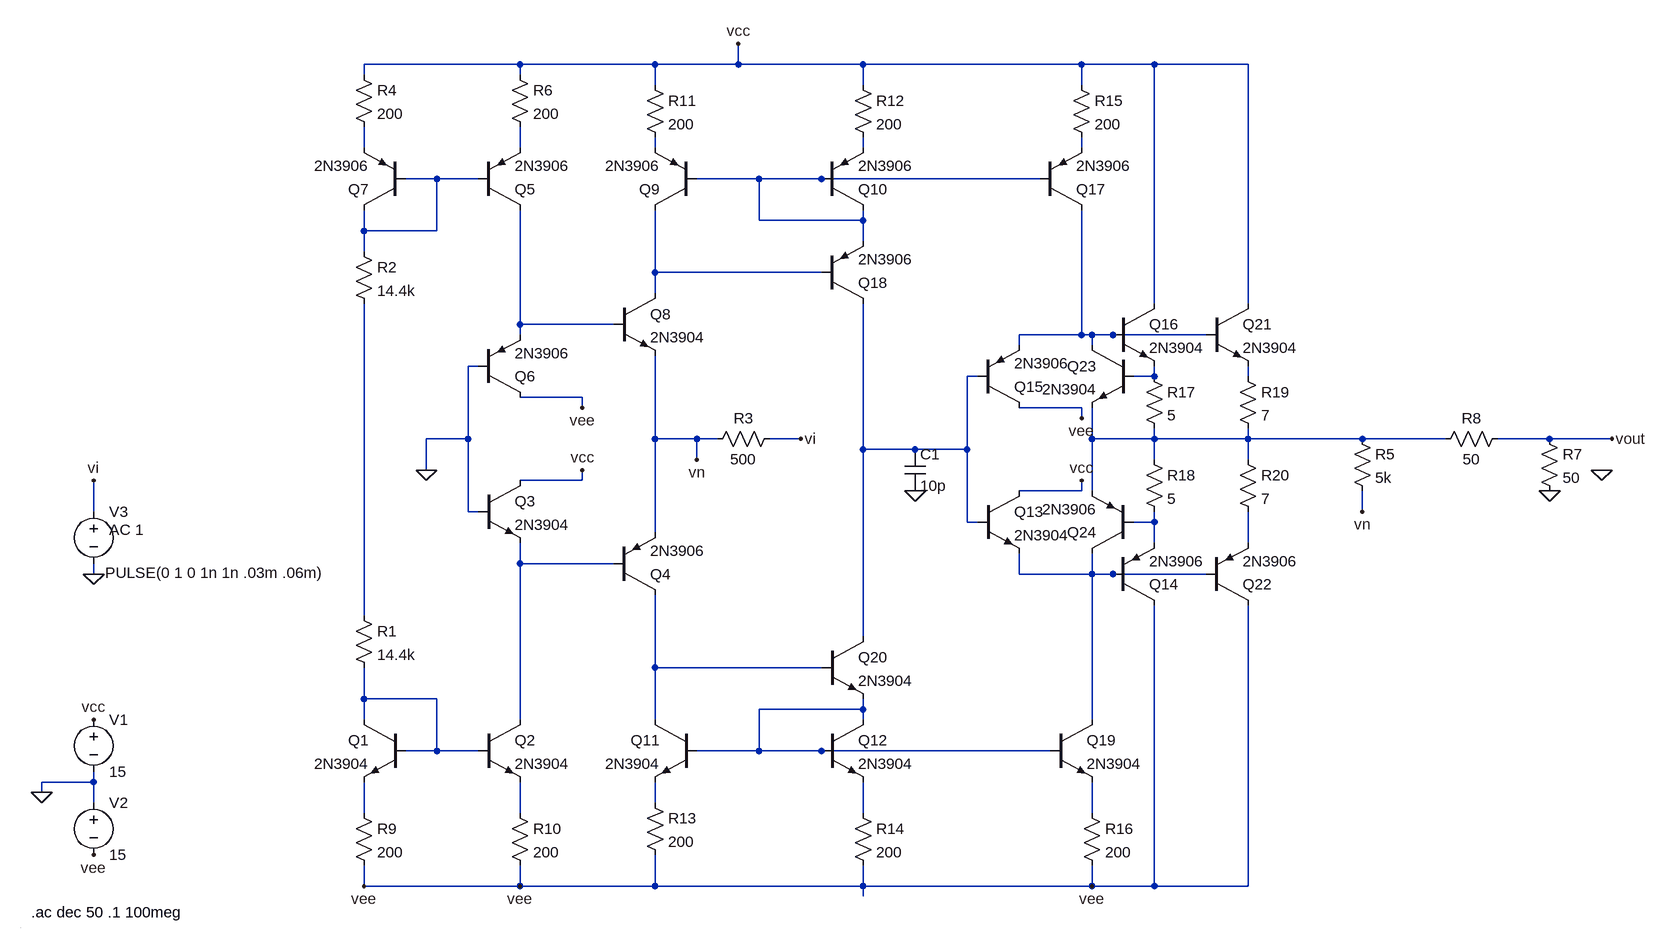
[diagram p0: schematic transimpedance_scratch.asc]
transimpedance_scratch.asc, the LTspice schematic file:
Version 4
SHEET 1 2516 680
WIRE 768 -1328 528 -1328
WIRE 976 -1328 768 -1328
WIRE 1104 -1328 1104 -1360
WIRE 1104 -1328 976 -1328
WIRE 1296 -1328 1104 -1328
WIRE 1632 -1328 1296 -1328
WIRE 1744 -1328 1632 -1328
WIRE 1888 -1328 1744 -1328
WIRE 528 -1312 528 -1328
WIRE 768 -1312 768 -1328
WIRE 976 -1296 976 -1328
WIRE 1296 -1296 1296 -1328
WIRE 1632 -1296 1632 -1328
WIRE 528 -1200 528 -1232
WIRE 768 -1200 768 -1232
WIRE 976 -1200 976 -1216
WIRE 1296 -1200 1296 -1216
WIRE 1632 -1200 1632 -1216
WIRE 640 -1152 592 -1152
WIRE 704 -1152 640 -1152
WIRE 1136 -1152 1040 -1152
WIRE 1232 -1152 1136 -1152
WIRE 1568 -1152 1232 -1152
WIRE 1136 -1088 1136 -1152
WIRE 1296 -1088 1296 -1104
WIRE 1296 -1088 1136 -1088
WIRE 528 -1072 528 -1104
WIRE 640 -1072 640 -1152
WIRE 640 -1072 528 -1072
WIRE 1296 -1056 1296 -1088
WIRE 528 -1040 528 -1072
WIRE 976 -1008 976 -1104
WIRE 1232 -1008 976 -1008
WIRE 976 -976 976 -1008
WIRE 1744 -960 1744 -1328
WIRE 1888 -960 1888 -1328
WIRE 768 -928 768 -1104
WIRE 912 -928 768 -928
WIRE 768 -912 768 -928
WIRE 1632 -912 1632 -1104
WIRE 1632 -912 1536 -912
WIRE 1648 -912 1632 -912
WIRE 1680 -912 1648 -912
WIRE 1824 -912 1680 -912
WIRE 1536 -896 1536 -912
WIRE 1648 -896 1648 -912
WIRE 704 -864 688 -864
WIRE 1472 -848 1456 -848
WIRE 1744 -848 1744 -864
WIRE 1744 -848 1712 -848
WIRE 1888 -848 1888 -864
WIRE 864 -816 768 -816
WIRE 864 -800 864 -816
WIRE 1632 -800 1536 -800
WIRE 1632 -784 1632 -800
WIRE 688 -752 688 -864
WIRE 688 -752 624 -752
WIRE 976 -752 976 -880
WIRE 1040 -752 976 -752
WIRE 1072 -752 1040 -752
WIRE 1200 -752 1152 -752
WIRE 1648 -752 1648 -800
WIRE 1744 -752 1744 -768
WIRE 1744 -752 1648 -752
WIRE 1888 -752 1888 -768
WIRE 1888 -752 1744 -752
WIRE 2064 -752 1888 -752
WIRE 2192 -752 2064 -752
WIRE 2352 -752 2272 -752
WIRE 2448 -752 2352 -752
WIRE 1296 -736 1296 -960
WIRE 1376 -736 1296 -736
WIRE 1456 -736 1456 -848
WIRE 1456 -736 1376 -736
WIRE 976 -608 976 -752
WIRE 1040 -720 1040 -752
WIRE 1744 -720 1744 -752
WIRE 1888 -720 1888 -752
WIRE 624 -704 624 -752
WIRE 864 -688 864 -704
WIRE 864 -688 768 -688
WIRE 1632 -672 1632 -688
WIRE 1632 -672 1536 -672
WIRE 1648 -672 1648 -752
WIRE 112 -640 112 -688
WIRE 688 -640 688 -752
WIRE 704 -640 688 -640
WIRE 2064 -640 2064 -672
WIRE 1456 -624 1456 -736
WIRE 1472 -624 1456 -624
WIRE 1744 -624 1744 -640
WIRE 1744 -624 1712 -624
WIRE 1744 -592 1744 -624
WIRE 1888 -592 1888 -640
WIRE 768 -560 768 -592
WIRE 912 -560 768 -560
WIRE 112 -544 112 -560
WIRE 1536 -544 1536 -576
WIRE 1648 -544 1648 -576
WIRE 1648 -544 1536 -544
WIRE 1680 -544 1648 -544
WIRE 1824 -544 1680 -544
WIRE 528 -480 528 -960
WIRE 1296 -448 1296 -736
WIRE 976 -400 976 -512
WIRE 1232 -400 976 -400
WIRE 528 -352 528 -400
WIRE 640 -352 528 -352
WIRE 1296 -336 1296 -352
WIRE 1296 -336 1136 -336
WIRE 528 -320 528 -352
WIRE 768 -320 768 -560
WIRE 976 -320 976 -400
WIRE 1296 -320 1296 -336
WIRE 1648 -320 1648 -544
WIRE 640 -272 640 -352
WIRE 640 -272 592 -272
WIRE 704 -272 640 -272
WIRE 1136 -272 1136 -336
WIRE 1136 -272 1040 -272
WIRE 1232 -272 1136 -272
WIRE 1584 -272 1232 -272
WIRE 112 -224 112 -240
WIRE 112 -224 32 -224
WIRE 32 -208 32 -224
WIRE 112 -192 112 -224
WIRE 976 -192 976 -224
WIRE 528 -176 528 -224
WIRE 768 -176 768 -224
WIRE 1296 -176 1296 -224
WIRE 1648 -176 1648 -224
WIRE 528 -64 528 -96
WIRE 768 -64 768 -96
WIRE 768 -64 528 -64
WIRE 976 -64 976 -112
WIRE 976 -64 768 -64
WIRE 1296 -64 1296 -96
WIRE 1296 -64 976 -64
WIRE 1648 -64 1648 -96
WIRE 1648 -64 1296 -64
WIRE 1744 -64 1744 -496
WIRE 1744 -64 1648 -64
WIRE 1888 -64 1888 -496
WIRE 1888 -64 1744 -64
WIRE 1296 -48 1296 -64
WIRE 0 0 0 0
FLAG 32 -208 0
FLAG 112 -320 vcc
FLAG 112 -112 vee
FLAG 528 -64 vee
FLAG 768 -64 vee
FLAG 1104 -1360 vcc
FLAG 864 -704 vcc
FLAG 864 -800 vee
FLAG 112 -544 0
FLAG 1632 -688 vcc
FLAG 1632 -784 vee
FLAG 1648 -64 vee
FLAG 2352 -672 0
FLAG 624 -704 0
FLAG 112 -688 vi
FLAG 1200 -752 vi
FLAG 1040 -720 vn
FLAG 2448 -752 vout
FLAG 2064 -640 vn
FLAG 1376 -672 0
FLAG 2432 -704 0
SYMBOL npn 704 -320 R0
SYMATTR InstName Q2
SYMATTR Value 2N3904
SYMBOL npn 592 -320 M0
SYMATTR InstName Q1
SYMATTR Value 2N3904
SYMBOL voltage 112 -336 R0
WINDOW 123 0 0 Left 0
WINDOW 39 0 0 Left 0
SYMATTR InstName V1
SYMATTR Value 15
SYMBOL voltage 112 -208 R0
WINDOW 123 0 0 Left 0
WINDOW 39 0 0 Left 0
SYMATTR InstName V2
SYMATTR Value 15
SYMBOL res 512 -496 R0
SYMATTR InstName R1
SYMATTR Value 14.4k
SYMBOL npn 704 -688 R0
SYMATTR InstName Q3
SYMATTR Value 2N3904
SYMBOL pnp 912 -512 M180
SYMATTR InstName Q4
SYMATTR Value 2N3906
SYMBOL pnp 704 -1104 M180
SYMATTR InstName Q5
SYMATTR Value 2N3906
SYMBOL pnp 704 -816 M180
SYMATTR InstName Q6
SYMATTR Value 2N3906
SYMBOL pnp 592 -1104 R180
SYMATTR InstName Q7
SYMATTR Value 2N3906
SYMBOL res 512 -1056 R0
SYMATTR InstName R2
SYMATTR Value 14.4k
SYMBOL npn 912 -976 R0
SYMATTR InstName Q8
SYMATTR Value 2N3904
SYMBOL voltage 112 -656 R0
WINDOW 3 18 110 Left 0
WINDOW 123 24 44 Left 0
WINDOW 39 0 0 Left 0
SYMATTR Value PULSE(0 1 0 1n 1n .03m .06m)
SYMATTR Value2 AC 1
SYMATTR InstName V3
SYMBOL pnp 1040 -1104 R180
SYMATTR InstName Q9
SYMATTR Value 2N3906
SYMBOL pnp 1232 -1104 M180
SYMATTR InstName Q10
SYMATTR Value 2N3906
SYMBOL npn 1040 -320 M0
SYMATTR InstName Q11
SYMATTR Value 2N3904
SYMBOL npn 1232 -320 R0
SYMATTR InstName Q12
SYMATTR Value 2N3904
SYMBOL npn 1472 -672 R0
SYMATTR InstName Q13
SYMATTR Value 2N3904
SYMBOL pnp 1680 -496 M180
SYMATTR InstName Q14
SYMATTR Value 2N3906
SYMBOL pnp 1472 -800 M180
SYMATTR InstName Q15
SYMATTR Value 2N3906
SYMBOL npn 1680 -960 R0
SYMATTR InstName Q16
SYMATTR Value 2N3904
SYMBOL pnp 1568 -1104 M180
SYMATTR InstName Q17
SYMATTR Value 2N3906
SYMBOL npn 1584 -320 R0
SYMATTR InstName Q19
SYMATTR Value 2N3904
SYMBOL res 2336 -768 R0
SYMATTR InstName R7
SYMATTR Value 50
SYMBOL res 2288 -768 R90
WINDOW 0 0 56 VBottom 0
WINDOW 3 32 56 VTop 0
SYMATTR InstName R8
SYMATTR Value 50
SYMBOL res 512 -1328 R0
SYMATTR InstName R4
SYMATTR Value 200
SYMBOL res 752 -1328 R0
SYMATTR InstName R6
SYMATTR Value 200
SYMBOL res 512 -192 R0
SYMATTR InstName R9
SYMATTR Value 200
SYMBOL res 752 -192 R0
SYMATTR InstName R10
SYMATTR Value 200
SYMBOL res 1168 -768 R90
WINDOW 0 0 56 VBottom 0
WINDOW 3 32 56 VTop 0
SYMATTR InstName R3
SYMATTR Value 500
SYMBOL res 2048 -768 R0
SYMATTR InstName R5
SYMATTR Value 5k
SYMBOL pnp 1232 -960 M180
SYMATTR InstName Q18
SYMATTR Value 2N3906
SYMBOL npn 1232 -448 R0
SYMATTR InstName Q20
SYMATTR Value 2N3904
SYMBOL cap 1360 -736 R0
SYMATTR InstName C1
SYMATTR Value 10p
SYMBOL res 960 -1312 R0
SYMATTR InstName R11
SYMATTR Value 200
SYMBOL res 1280 -1312 R0
SYMATTR InstName R12
SYMATTR Value 200
SYMBOL res 960 -208 R0
SYMATTR InstName R13
SYMATTR Value 200
SYMBOL res 1280 -192 R0
SYMATTR InstName R14
SYMATTR Value 200
SYMBOL res 1616 -1312 R0
SYMATTR InstName R15
SYMATTR Value 200
SYMBOL res 1632 -192 R0
SYMATTR InstName R16
SYMATTR Value 200
SYMBOL res 1728 -864 R0
SYMATTR InstName R17
SYMATTR Value 5
SYMBOL res 1728 -736 R0
SYMATTR InstName R18
SYMATTR Value 5
SYMBOL npn 1824 -960 R0
SYMATTR InstName Q21
SYMATTR Value 2N3904
SYMBOL pnp 1824 -496 M180
SYMATTR InstName Q22
SYMATTR Value 2N3906
SYMBOL res 1872 -864 R0
SYMATTR InstName R19
SYMATTR Value 7
SYMBOL res 1872 -736 R0
SYMATTR InstName R20
SYMATTR Value 7
SYMBOL npn 1712 -896 M0
SYMATTR InstName Q23
SYMATTR Value 2N3904
SYMBOL pnp 1712 -576 R180
SYMATTR InstName Q24
SYMATTR Value 2N3906
TEXT 16 -24 Left 0 !.ac dec 50 .1 100meg

The netlist it stands for:
* transimpedance_scratch.asc
Q2 N017 N021 N025 0 2N3904
Q1 N021 N021 N024 0 2N3904
V1 vcc 0 15
V2 0 vee 15
R1 N019 N021 14.4k
Q3 vcc 0 N017 0 2N3904
Q4 N020 N017 vn 0 2N3906
Q5 N009 N006 N002 0 2N3906
Q6 vee 0 N009 0 2N3906
Q7 N006 N006 N001 0 2N3906
R2 N006 N019 14.4k
Q8 N008 N009 vn 0 2N3904
V3 vi 0 PULSE(0 1 0 1n 1n .03m .06m) AC 1
Q9 N008 N007 N003 0 2N3906
Q10 N007 N007 N004 0 2N3906
Q11 N020 N022 N023 0 2N3904
Q12 N022 N022 N026 0 2N3904
Q13 vcc N011 N018 0 2N3904
Q14 vee N018 N015 0 2N3906
Q15 vee N011 N010 0 2N3906
Q16 vcc N010 N012 0 2N3904
Q17 N010 N007 N005 0 2N3906
Q19 N018 N022 N027 0 2N3904
R7 vout 0 50
R8 vout N014 50
R4 vcc N001 200
R6 vcc N002 200
R9 N024 vee 200
R10 N025 vee 200
R3 vi vn 500
R5 N014 vn 5k
Q18 N011 N008 N007 0 2N3906
Q20 N011 N020 N022 0 2N3904
C1 N011 0 10p
R11 vcc N003 200
R12 vcc N004 200
R13 N023 vee 200
R14 N026 vee 200
R15 vcc N005 200
R16 N027 vee 200
R17 N012 N014 5
R18 N014 N015 5
Q21 vcc N010 N013 0 2N3904
Q22 vee N018 N016 0 2N3906
R19 N013 N014 7
R20 N014 N016 7
Q23 N010 N012 N014 0 2N3904
Q24 N018 N015 N014 0 2N3906
.model NPN NPN
.model PNP PNP
.lib standard.bjt
.ac dec 50 .1 100meg
.backanno
.end